# EAGLE design Splipeater (EAGLE 5.11)
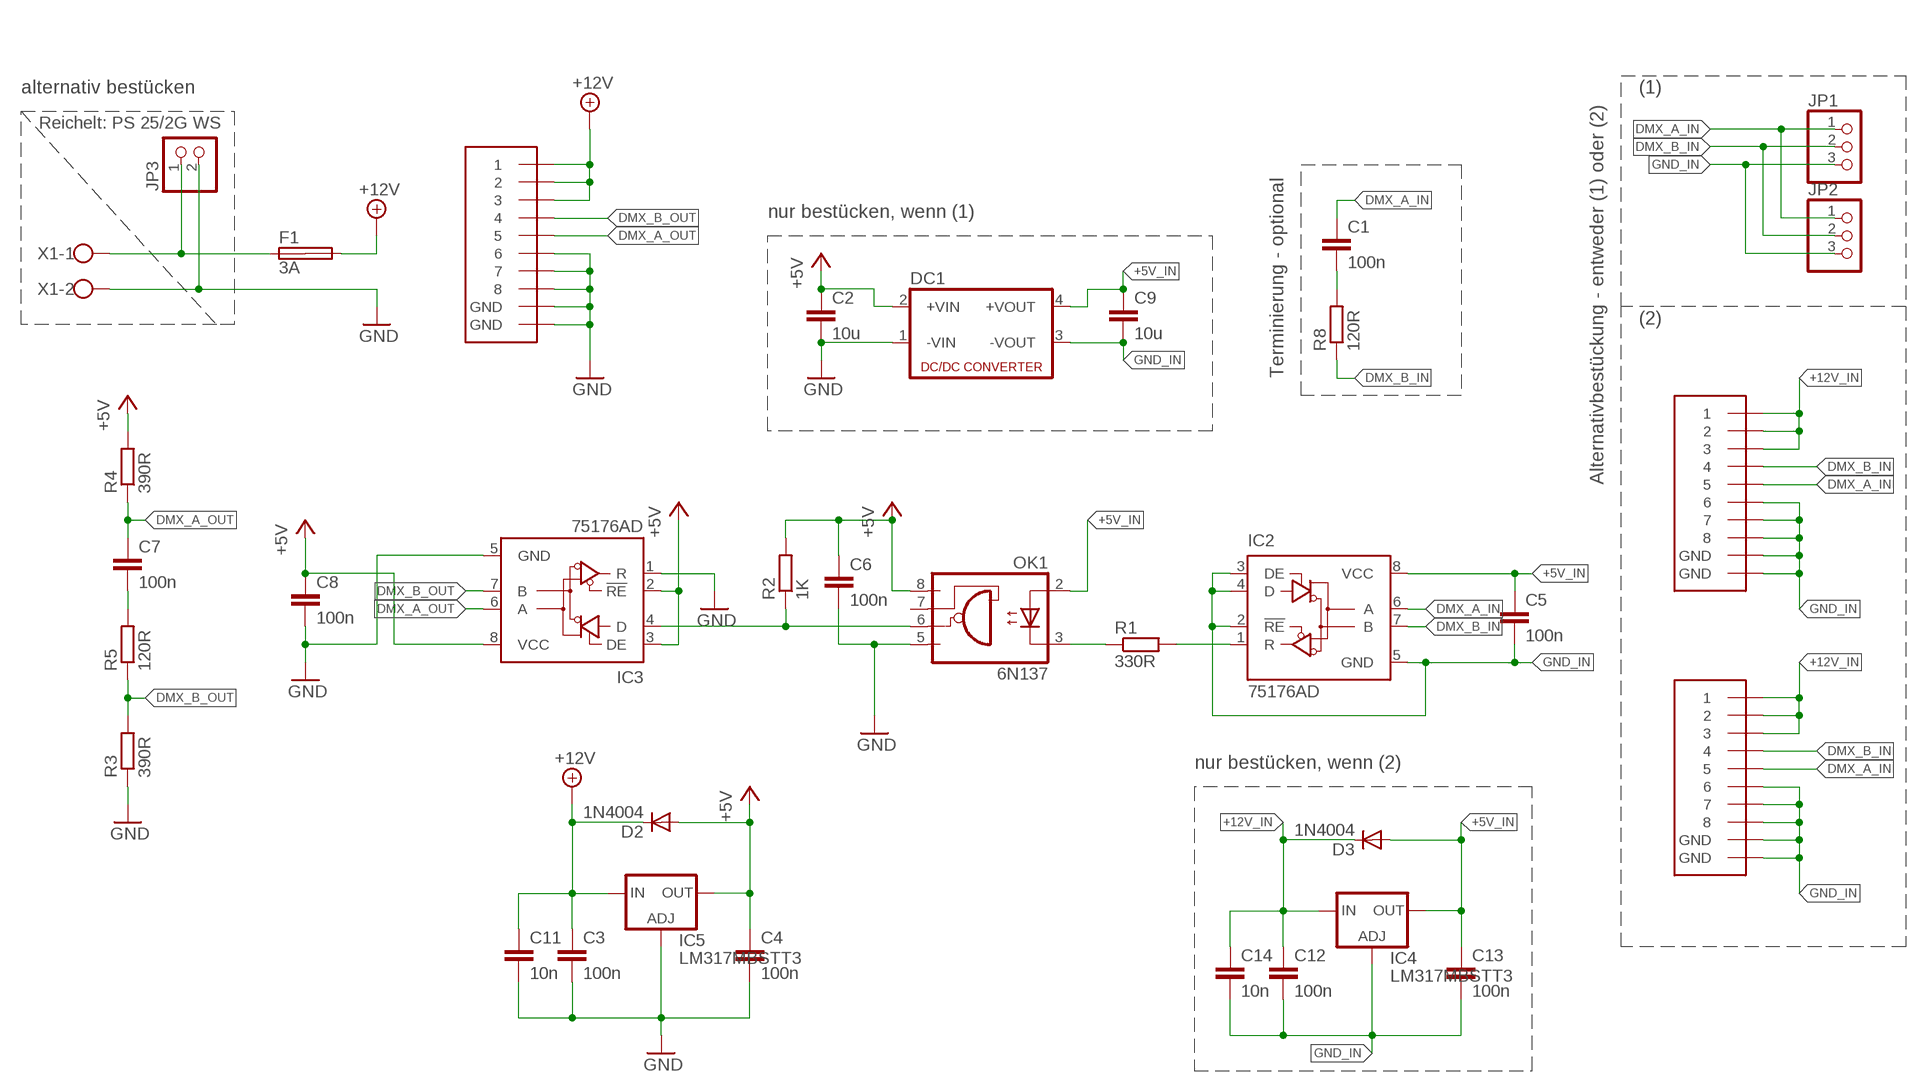
[diagram p0: schematic, sheet 1]

## Parts
C1  100n  C-EUC0805  [C0805]
C2  10u  C-EUC1210  [C1210]
C3  100n  C-EUC0805  [C0805]
C4  100n  C-EUC0805  [C0805]
C5  100n  C-EUC0805  [C0805]
C6  100n  C-EUC0805  [C0805]
C7  100n  C-EUC0805  [C0805]
C8  100n  C-EUC0805  [C0805]
C9  10u  C-EUC1210  [C1210]
C11  10n  C-EUC0805  [C0805]
C12  100n  C-EUC0805  [C0805]
C13  100n  C-EUC0805  [C0805]
C14  10n  C-EUC0805  [C0805]
D2  1N4004  DIODE-SOD323-W  [SOD323-W]
D3  1N4004  DIODE-SOD323-W  [SOD323-W]
DC1  NME  [NME]
F1  3A  SHK20L  [SHK20L]
IC2  75176AD  [D_R-PDSO-G8]
IC3  75176AD  [D_R-PDSO-G8]
IC4  LM317MBSTT3  [SOT223]
IC5  LM317MBSTT3  [SOT223]
JP1  PINHD-1X3  [1X03]
JP2  PINHD-1X3  [1X03]
JP3  PINHD-1X2  [1X02]
OK1  6N137  [DIL08]
R1  330R  R-EU_R0805  [R0805]
R2  1K  R-EU_R0805  [R0805]
R3  390R  R-EU_R0805  [R0805]
R4  390R  R-EU_R0805  [R0805]
R5  120R  R-EU_R0805  [R0805]
R8  120R  R-EU_R0805  [R0805]
U$1  MEBP8-8G  [RJ45-REICHELT]
U$2  MEBP8-8G  [RJ45-REICHELT]
U$3  MEBP8-8G  [RJ45-REICHELT]
X1  W237-102  [W237-102]

## Nets
+5V: C2.1 C4.1 C6.1 C8.1 D2.A DC1.2(+VIN) IC3.2(!RE) IC3.3(DE) IC3.8(VCC) IC5.4(OUT) OK1.8(VCC) R2.2 R4.2
+5V_IN: C5.1 C9.1 C13.1 D3.A DC1.4(+VOUT) IC2.8(VCC) IC4.4(OUT) OK1.2(A)
+12V: C3.1 C11.1 D2.C F1.2A IC5.3(IN) U$1.1 U$1.2 U$1.3
+12V_IN: C12.1 C14.1 D3.C IC4.3(IN) U$2.1 U$2.2 U$2.3 U$3.1 U$3.2 U$3.3
DMX_A_IN: C1.1 IC2.6(A) JP1.1 JP2.1 U$2.5 U$3.5
DMX_A_OUT: C7.1 IC3.6(A) R4.1 U$1.5
DMX_B_IN: IC2.7(B) JP1.2 JP2.2 R8.1 U$2.4 U$3.4
DMX_B_OUT: IC3.7(B) R3.2 R5.1 U$1.4
GND: C2.2 C3.2 C4.2 C6.2 C8.2 C11.2 DC1.1(-VIN) IC3.1(R) IC3.5(GND) IC5.1(ADJ) JP3.2 OK1.5(GND) R3.1 U$1.6 U$1.7 U$1.8 U$1.GND@1(GND) U$1.GND@2(GND) X1.2
GND_IN: C5.2 C9.2 C12.2 C13.2 C14.2 DC1.3(-VOUT) IC2.2(!RE) IC2.3(DE) IC2.4(D) IC2.5(GND) IC4.1(ADJ) JP1.3 JP2.3 U$2.6 U$2.7 U$2.8 U$2.GND@1(GND) U$2.GND@2(GND) U$3.6 U$3.7 U$3.8 U$3.GND@1(GND) U$3.GND@2(GND)
N$1: F1.1A JP3.1 X1.1
N$2: C1.2 R8.2
N$4: IC2.1(R) R1.2
N$5: OK1.3(C) R1.1
N$6: IC3.4(D) OK1.6(VO) R2.1
N$12: C7.2 R5.2
Unconnected: F1.1B F1.2B OK1.7(VE)

## Notes on the sheet
- alternativ bestücken | (1)
- Reichelt: PS 25/2G WS
- nur bestücken, wenn (1)
- (2)
- Terminierung - optional
- Alternativbestückung - entweder (1) oder (2)
- nur bestücken, wenn (2)

## Library data of the parts
C1-C9 C11-C14 = rcl:C-EU: CAPACITOR, European symbol
D2 D3 = diode:DIODE-: DIODE
DC1 = dc-dc-converter:NME: DC-DC CONVERTER; MF: C & D TECHNOLOGIES, INC; MPN: NME1205D; OC_FARNELL: 1021466; OC_NEWARK: 98B8198
F1 = fuse:SHK20L: FUSE HOLDER 5 x 20 mm, SH contact, SHH1 Schukat, E1073 Buerklin; OC_FARNELL: unknown; OC_NEWARK: unknown
IC2 IC3 = 751xx:75176A: DIFFERENTIAL BUS TRANSCEIVER Source: http://focus.ti.com/lit/ds/symlink/sn75176a.pdf
IC4 IC5 = v-reg:LM317?*: 500 mA Adjustable Output Positive Voltage Regulator Source: http://www.onsemi.co.jp .. LM317M-D.PDF
JP1 JP2 = pinhead:PINHD-1X3: PIN HEADER
JP3 = pinhead:PINHD-1X2: PIN HEADER
OK1 = optocoupler:6N137: MOTOROLA OPTO COUPLER; MPN: 6N137; OC_FARNELL: 1328376; OC_NEWARK: 52M1895
R1-R5 R8 = rcl:R-EU_: RESISTOR, European symbol
U$1-U$3 = Reichelt:MEBP8-8G
X1 = con-wago-500:W237-102: WAGO SCREW CLAMP; MPN: 237-102; OC_FARNELL: unknown; OC_NEWARK: 70K9898

## Board
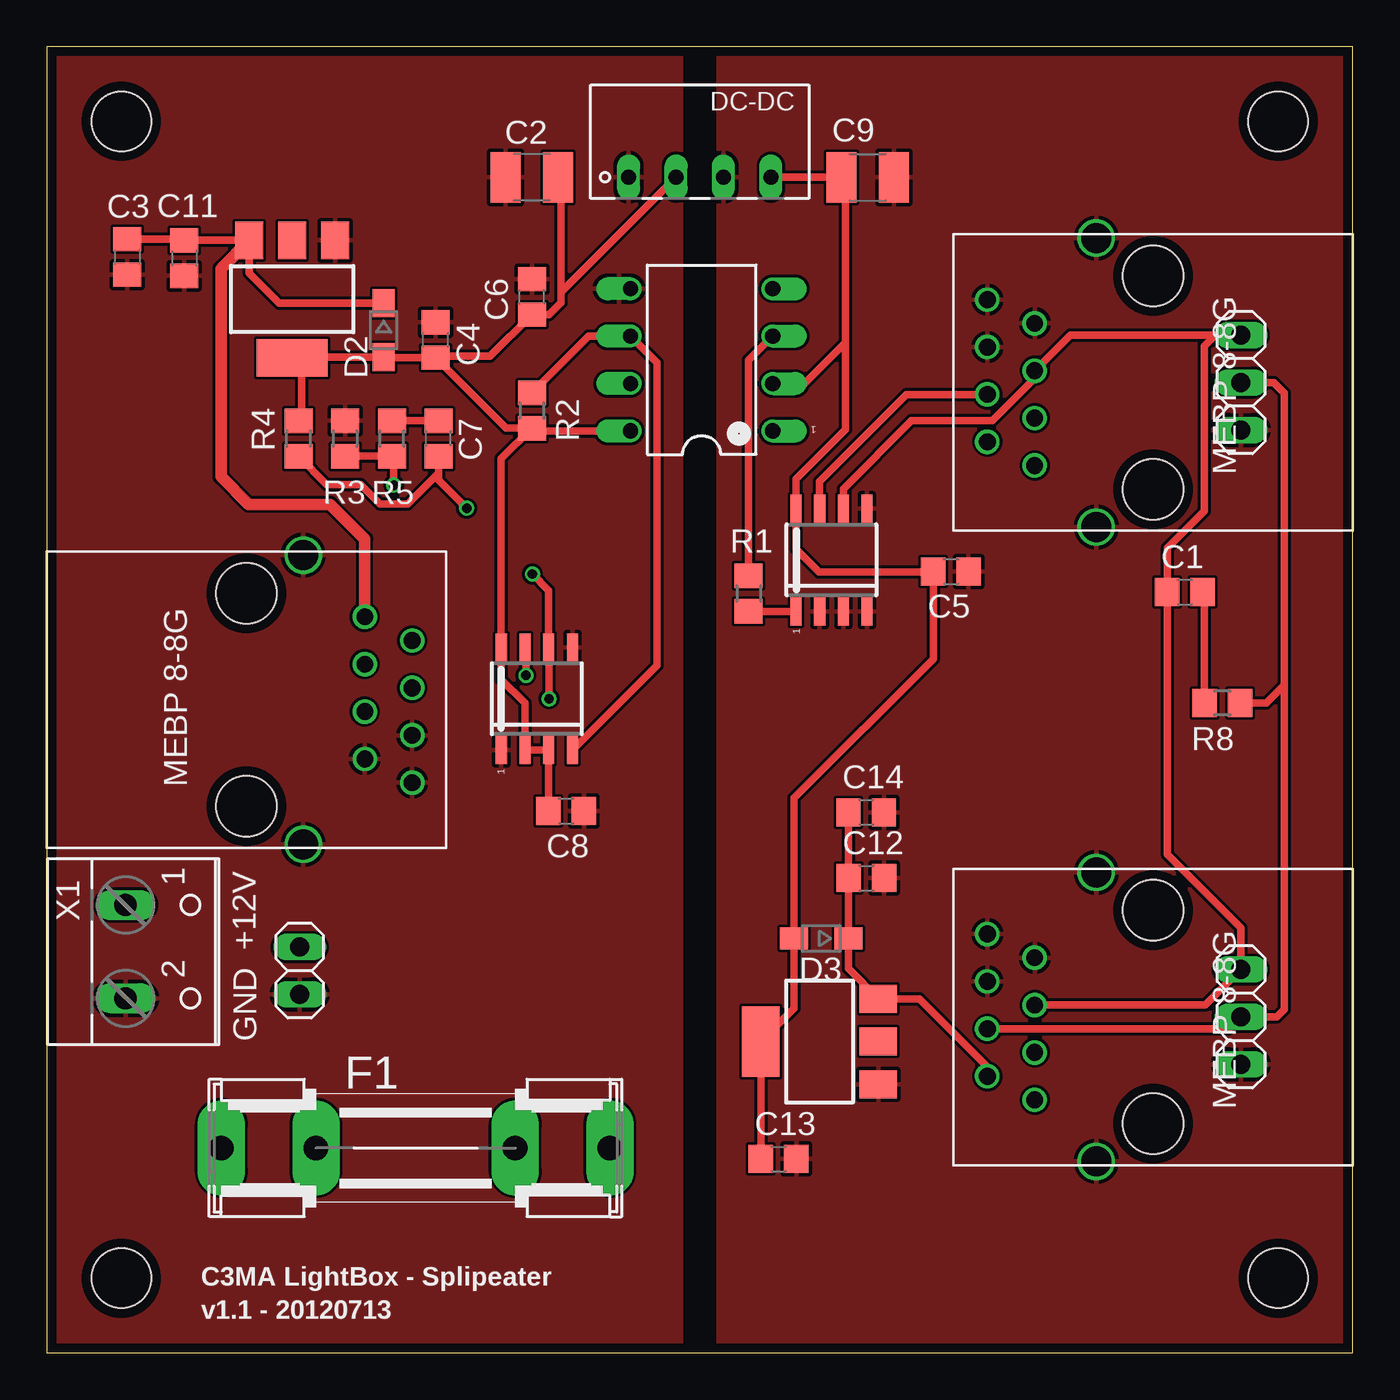
[diagram p1: board, top side]
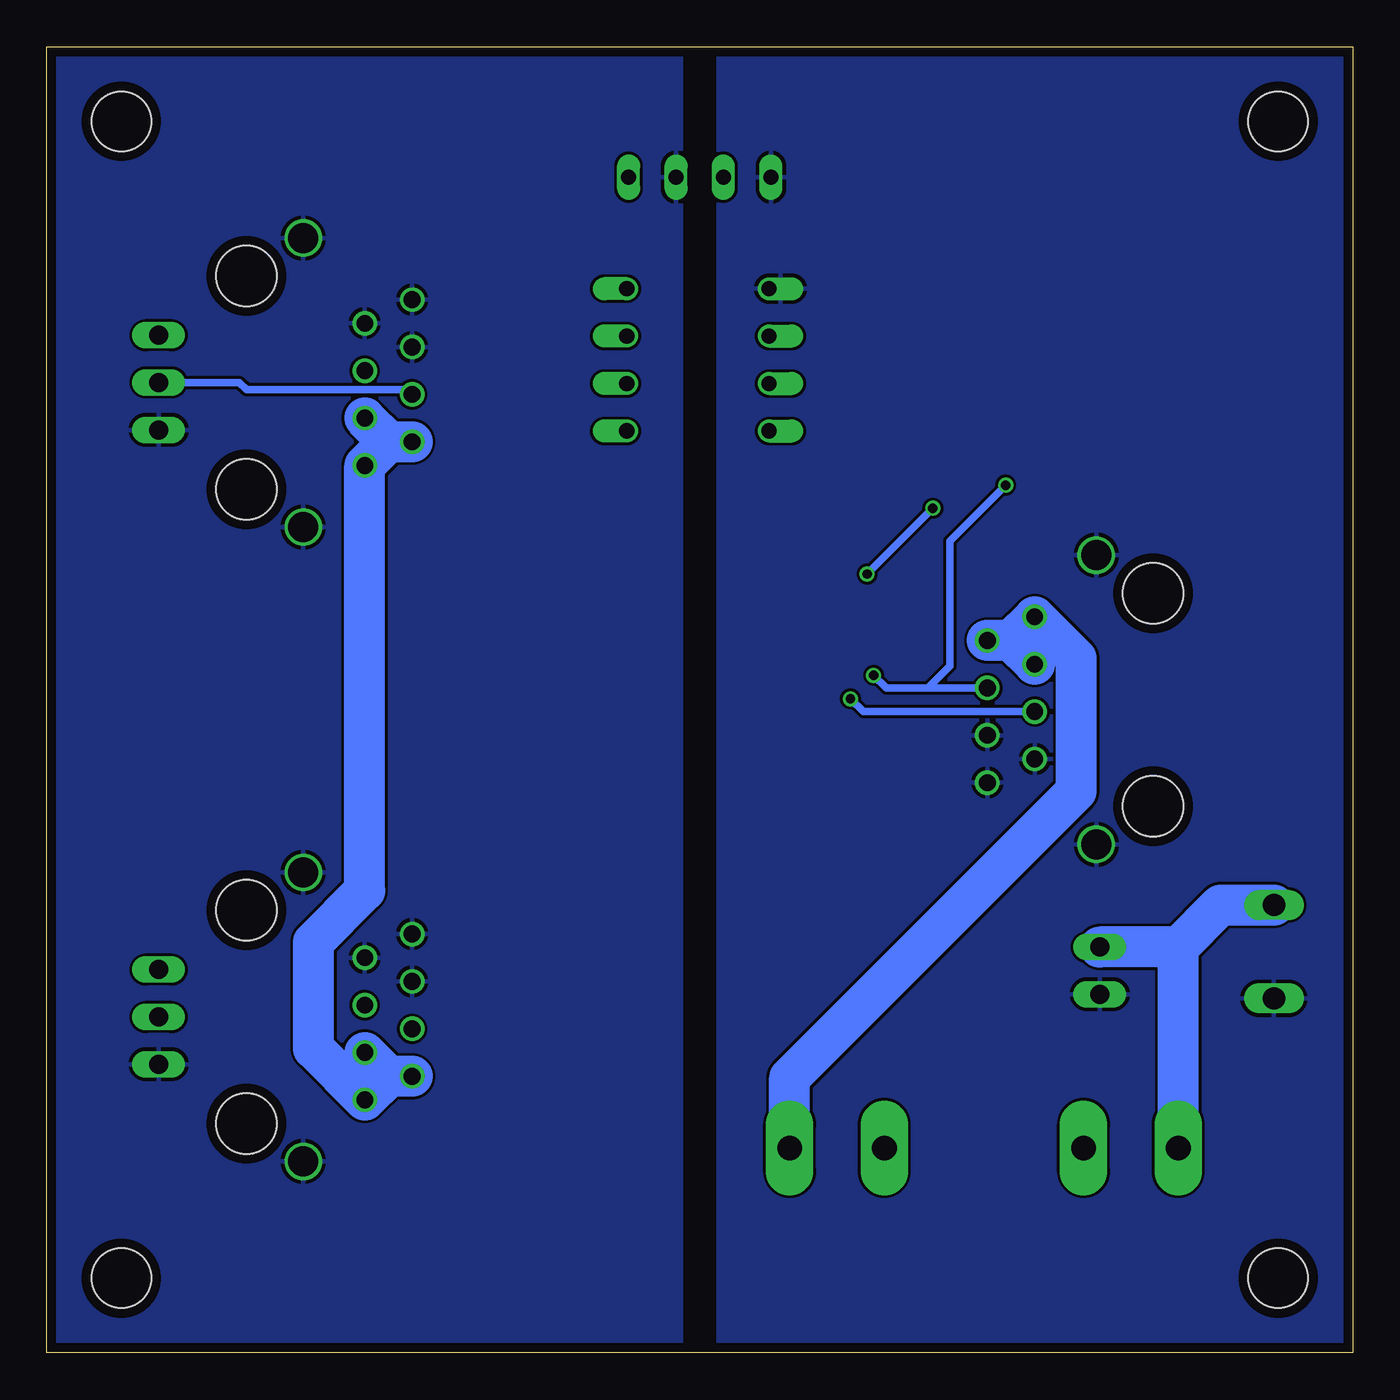
[diagram p2: board, bottom side, seen from below]

Size 70 x 70 mm. Coordinates in mm from the lower left corner, seen from the top.
Outline: 0,0 70,0 70,70 0,70 0,0
Copper layers (1*16): Top 0.035mm / dielectric 1.5mm / Bottom 0.035mm
Design rules "Eagle-DRU - 1109 - LeitOn - 01 and 02 layers": minimum track width 6mil, minimum drill 0.3mm, track to track 6mil, track to pad 6mil, pad to pad 6mil, via to via 6mil, smd to smd 6mil, copper to edge 20mil, drill to drill 10mil, minimum pad ring 8mil, minimum via ring 6mil, stop-mask expansion 3mil, vias tented up to drill 0mil, thermal gap 8mil
Holes 3.2 mm at 4,4 4,66 66,66 66,4

### Footprints (pad centres in the part's own frame; a part is rotated, then mirrored left to right if it is on the bottom)
C0805 = smd 1.3 x 1.5: 1 -0.95,0; 2 0.95,0
C1210 = smd 1.6 x 2.7: 1 -1.4,0; 2 1.4,0
SOD323-W = smd 1.5 x 1.2: A 1.45,0; C -1.45,0
NME = drill 0.813 long: 1 0,3.81; 2 0,1.27; 3 0,-1.27; 4 0,-3.81
SHK20L = drill 1.321 pad 2.54 long: 1A -10.414,0; 1B -5.334,0; 2A 10.414,0; 2B 5.334,0
D_R-PDSO-G8 = smd 0.6 x 1.5: 1 -1.905,-2.75; 2 -0.635,-2.75; 3 0.635,-2.75; 4 1.905,-2.75; 5 1.905,2.75; 6 0.635,2.75; 7 -0.635,2.75; 8 -1.905,2.75
SOT223 = smd 1.5 x 2: 1 -2.3,-3.15; 2 0,-3.15; 3 2.3,-3.15 | smd 3.8 x 2: 4 0,3.15
1X03 = drill 1.016 long: 1 -2.54,0; 2 0,0; 3 2.54,0
1X02 = drill 1.016 long: 1 -1.27,0; 2 1.27,0
DIL08 = drill 0.813 offset: 1 -3.81,-3.81; 2 -1.27,-3.81; 3 1.27,-3.81; 4 3.81,-3.81; 5 3.81,3.81; 6 1.27,3.81; 7 -1.27,3.81; 8 -3.81,3.81
R0805 = smd 1.3 x 1.5: 1 -0.95,0; 2 0.95,0
RJ45-REICHELT = drill 0.9 round: 1 -4.445,6.35; 2 -3.175,8.89; 3 -1.905,6.35; 4 -0.635,8.89; 5 0.635,6.35; 6 1.905,8.89; 7 3.175,6.35; 8 4.445,8.89 | drill 1.6 round: GND@1 -7.745,3.05; GND@2 7.745,3.05 | hole 3.25: -5.715,0; 5.715,0
W237-102 = drill 1.194 long: 1 -2.5,-1.27; 2 2.5,-1.27

### Placement (x,y rotation side)
C1  61,40.77 0 top
C2  26,63 180 top
C3  4.32,58.73 270 top
C4  20.84,54.28 90 top
C5  48.46,41.87 0 top
C6  26,56.59 90 top
C7  21,49 90 top
C8  27.84,29.04 0 top
C9  44,63 0 top
C11  7.38,58.67 270 top
C12  43.93,25.44 0 top
C13  39.22,10.39 0 top
C14  43.92,28.97 0 top
D2  18.06,54.8 270 top
D3  41.51,22.21 180 top
DC1  35,63 90 top
F1  19.77,10.98 0 top
IC2  42.06,42.49 0 top
IC3  26.27,35.06 0 top
IC4  41.42,16.68 90 top
IC5  13.16,56.47 180 top
JP1  64,52 270 top
JP2  64,18 270 top
JP3  13.56,20.48 270 top
OK1  35.1,53.22 90 top
R1  37.62,40.69 270 top
R2  26,50.5 270 top
R3  16,49 270 top
R4  13.5,49 90 top
R5  18.5,49 90 top
R8  63,34.83 180 top
U$1  10.7,35 270 top
U$2  59.3,52 90 top
U$3  59.3,18 90 top
X1  5.5,21.5 270 top

### Tracks (layer width: path | path; a pad name or v marks a point on that pad's centre or on a via)
+5V
  Top 0.406: C4.1 20.84,53.41 23.77,53.41 C6.1 26.92,55.64 27.57,56.29 27.57,56.85 | C4.1 18.06,53.33 D2.A 13.66,53.35 | 13.66,53.35 13.16,53.35 IC5.4 | R4.2 13.66,50.11 13.66,53.35 | OK1.8 26.14,49.41 arc-90 R2.2 | R2.2 24.62,49.55 C4.1 | 27.57,56.85 27.57,62.98 C2.1 | DC1.2 27.58,56.85 27.57,56.85 | R2.2 24.36,47.91 IC3.8 24.36,36.09 25.64,34.82 IC3.2 IC3.3 26.91,29.05 C8.1
+5V_IN
  Top 0.406: DC1.4 C9.1 42.8,62.98 42.8,54.15 | OK1.2 40.6,51.95 42.8,54.15 | 42.8,54.15 42.8,49.48 40.16,46.84 IC2.8 40.16,43.06 41.38,41.84 47.48,41.84 C5.1 47.52,37.19 40.06,29.73 D3.A 40.06,18.47 IC4.4 C13.1
+12V
  Top 0.406: C3.1 7.38,59.68 C11.1 IC5.3 10.86,57.87 12.47,56.26 D2.C
  Top 0.61: IC5.3 9.35,58.11 9.35,46.95 10.83,45.47 15.2,45.47 17.05,43.62 U$1.1
  Bottom 2.184: 18.32,38.17 U$1.3 | 18.32,38.17 U$1.1 14.82,37.22 14.82,30.11 30.18,14.75 F1.2A | 18.32,38.17 U$1.2
+12V_IN
  Top 0.406: U$3.2 50.41,15.33 46.76,18.98 IC4.3 42.96,20.59 D3.C 42.98,22.23 C12.1 C14.1
  Bottom 2.184: 51.68,48.83 U$2.3 | 51.68,48.83 U$2.1 52.95,24.77 55.7,22.02 55.7,16.3 U$3.1 51.68,14.82 | 51.68,48.83 U$2.2 | U$3.2 51.68,14.82 | 51.68,14.82 U$3.3
DMX_A_IN
  Top 0.406: 62.63,54.54 54.85,54.54 U$2.5 52.95,52.23 50.67,49.95 46.35,49.95 42.7,46.3 IC2.6 | 62.63,54.54 JP1.1 | 62.63,54.54 62.05,53.96 62.05,45.12 60.05,43.12 C1.1 60.05,26.72 64,22.77 JP2.1 | JP2.1 63.98,20.56 | U$3.5 62.09,18.64 JP2.1
DMX_A_OUT  (via drill 0.5)
  Top 0.406: R4.1 15.01,46.54 16.83,46.54 17.87,45.5 19.35,45.5 21,47.15 C7.1 21,46.77 v22.51,45.26 | v26.92,35.05 26.92,37.8 IC3.6 26.91,40.87 v26.03,41.74
  Bottom 0.406: U$1.5 26.23,34.37 v26.92,35.05 | v26.03,41.74 v22.51,45.26
DMX_B_IN
  Top 0.406: IC2.7 41.42,46.7 46.07,51.35 50.4,51.35 U$2.4 | JP1.2 65.75,52 66.33,51.42 66.33,35.79 | JP2.2 | JP2.2 65.93,18 66.33,18.4 66.33,35.79 | R8.1 65.37,34.83 66.33,35.79 | U$3.4 63.37,17.36 JP2.2
  Bottom 0.406: U$2.4 50.66,51.61 59.29,51.61 59.68,52 JP1.2
DMX_B_OUT  (via drill 0.5)
  Top 0.406: R3.2 R5.1 18.6,47.95 v18.6,46.5 | IC3.7 25.68,37.77 v25.68,36.31
  Bottom 0.406: v18.6,46.5 21.6,43.5 21.6,36.81 22.78,35.63 | 20.07,35.63 U$1.4 22.78,35.63 | v25.68,36.31 25,35.63 22.78,35.63
GND
  pour Bottom: 0,0 34,0 34,70 0,70
  pour Top: 0,0 34,0 34,70 0,70
GND_IN
  pour Top: 36,0 70,0 70,70 36,70
  pour Bottom: 36,0 70,0 70,70 36,70
N$1
  Bottom 2.184: X1.1 7.09,24 9.35,21.74 9.35,21.64 | 9.35,21.64 F1.1A | JP3.1 9.46,21.75 9.35,21.64
N$2
  Top 0.406: R8.2 62.05,40.67 C1.2
N$4
  Top 0.406: R1.2 IC2.1
N$5
  Top 0.406: OK1.3 37.62,53.2 R1.1
N$6
  Top 0.406: R2.1 29.04,54.49 OK1.6 32.7,53.08 32.7,36.84 IC3.4
N$12
  Top 0.406: R5.2 C7.2

### Text on the board
tPlace: 1 | 1 | 1 | +12V | GND | C3MA LightBox - Splipeater | v1.1 - 20120713